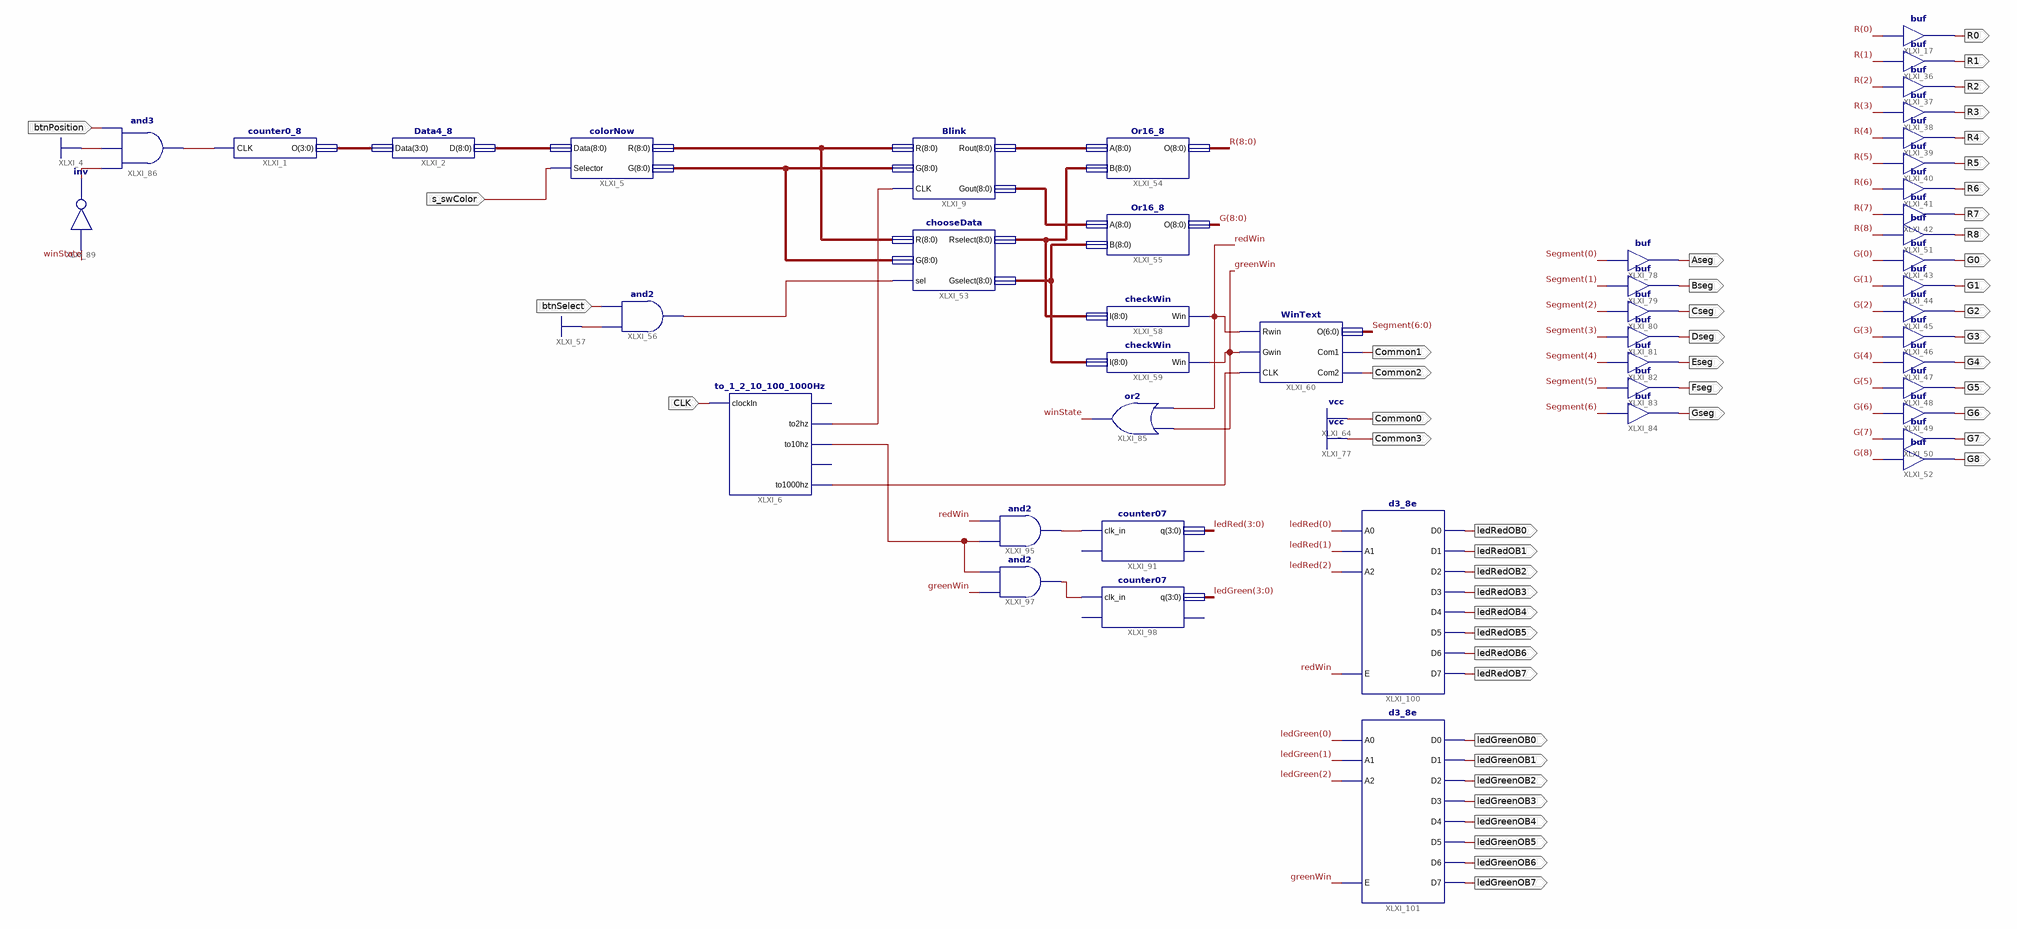
[diagram p0: schematic sheet 1]
// Xilinx ISE schematic main.sch (spartan6) as structural Verilog: 46 symbols, 50 ports
module main (
  input  s_swColor,
  input  btnSelect,
  input  CLK,
  input  btnPosition,
  output R0,
  output R1,
  output R2,
  output R3,
  output R4,
  output R5,
  output R6,
  output R7,
  output G0,
  output G1,
  output G2,
  output G3,
  output G4,
  output G5,
  output G6,
  output G7,
  output R8,
  output G8,
  output redWin,
  output Common1,
  output Common2,
  output Common0,
  output Common3,
  output Aseg,
  output Bseg,
  output Cseg,
  output Dseg,
  output Eseg,
  output Fseg,
  output Gseg,
  output ledRedOB0,
  output ledRedOB1,
  output ledRedOB2,
  output ledRedOB3,
  output ledRedOB4,
  output ledRedOB5,
  output ledRedOB6,
  output ledRedOB7,
  output ledGreenOB0,
  output ledGreenOB1,
  output ledGreenOB2,
  output ledGreenOB3,
  output ledGreenOB4,
  output ledGreenOB5,
  output ledGreenOB6,
  output ledGreenOB7
);

  wire greenWin, winState, XLXN_4, XLXN_13, XLXN_128, XLXN_140, XLXN_166, XLXN_180, XLXN_182, XLXN_184;
  wire [3:0] ledGreen, ledRed, XLXN_1;
  wire [6:0] Segment;
  wire [8:0] G, R, XLXN_5, XLXN_10, XLXN_11, XLXN_116, XLXN_118, XLXN_170, XLXN_171;

  counter0_8 XLXI_1 (.CLK(XLXN_4), .O(XLXN_1));
  Data4_8 XLXI_2 (.Data(XLXN_1), .D(XLXN_5));
  colorNow XLXI_5 (.Data(XLXN_5), .Selector(s_swColor), .R(XLXN_10), .G(XLXN_11));
  Blink XLXI_9 (.R(XLXN_10), .G(XLXN_11), .CLK(XLXN_13), .Rout(XLXN_116), .Gout(XLXN_118));
  buf XLXI_17 (R0, R[0]);
  buf XLXI_36 (R1, R[1]);
  buf XLXI_37 (R2, R[2]);
  buf XLXI_38 (R3, R[3]);
  buf XLXI_39 (R4, R[4]);
  buf XLXI_40 (R5, R[5]);
  buf XLXI_41 (R6, R[6]);
  buf XLXI_42 (R7, R[7]);
  buf XLXI_43 (G0, G[0]);
  buf XLXI_44 (G1, G[1]);
  buf XLXI_45 (G2, G[2]);
  buf XLXI_46 (G3, G[3]);
  buf XLXI_47 (G4, G[4]);
  buf XLXI_48 (G5, G[5]);
  buf XLXI_49 (G6, G[6]);
  buf XLXI_50 (G7, G[7]);
  buf XLXI_51 (R8, R[8]);
  buf XLXI_52 (G8, G[8]);
  chooseData XLXI_53 (.R(XLXN_10), .G(XLXN_11), .sel(XLXN_128), .Rselect(XLXN_170), .Gselect(XLXN_171));
  Or16_8 XLXI_54 (.A(XLXN_116), .B(XLXN_170), .O(R));
  Or16_8 XLXI_55 (.A(XLXN_118), .B(XLXN_171), .O(G));
  and XLXI_56 (XLXN_128, 1'b1, btnSelect);
  checkWin XLXI_58 (.I(XLXN_170), .Win(redWin));
  checkWin XLXI_59 (.I(XLXN_171), .Win(greenWin));
  WinText XLXI_60 (.Rwin(redWin), .Gwin(greenWin), .CLK(XLXN_140), .Com2(Common2), .Com1(Common1), .O(Segment));
  to_1_2_10_100_1000Hz XLXI_6 (
    .clockIn(CLK), .to2hz(XLXN_13), .to10hz(XLXN_180), .to1000hz(XLXN_140));  // open: to1hz, to100hz
  buf XLXI_78 (Aseg, Segment[0]);
  buf XLXI_79 (Bseg, Segment[1]);
  buf XLXI_80 (Cseg, Segment[2]);
  buf XLXI_81 (Dseg, Segment[3]);
  buf XLXI_82 (Eseg, Segment[4]);
  buf XLXI_83 (Fseg, Segment[5]);
  buf XLXI_84 (Gseg, Segment[6]);
  or XLXI_85 (winState, redWin, greenWin);
  and XLXI_86 (XLXN_4, XLXN_166, 1'b1, btnPosition);
  not XLXI_89 (XLXN_166, winState);
  counter07 XLXI_91 (.clk_in(XLXN_182), .q(ledRed));  // open: clear, divide_8
  and XLXI_95 (XLXN_182, XLXN_180, redWin);
  and XLXI_97 (XLXN_184, greenWin, XLXN_180);
  counter07 XLXI_98 (.clk_in(XLXN_184), .q(ledGreen));  // open: clear, divide_8
  d3_8e XLXI_100 (
    .A0(ledRed[0]), .A1(ledRed[1]), .A2(ledRed[2]), .E(redWin), .D0(ledRedOB0), .D1(ledRedOB1),
    .D2(ledRedOB2), .D3(ledRedOB3), .D4(ledRedOB4), .D5(ledRedOB5), .D6(ledRedOB6), .D7(ledRedOB7));
  d3_8e XLXI_101 (
    .A0(ledGreen[0]), .A1(ledGreen[1]), .A2(ledGreen[2]), .E(greenWin), .D0(ledGreenOB0), .D1(ledGreenOB1),
    .D2(ledGreenOB2), .D3(ledGreenOB3), .D4(ledGreenOB4), .D5(ledGreenOB5), .D6(ledGreenOB6), .D7(ledGreenOB7));

  assign Common0 = 1'b1;
  assign Common3 = 1'b1;
endmodule
